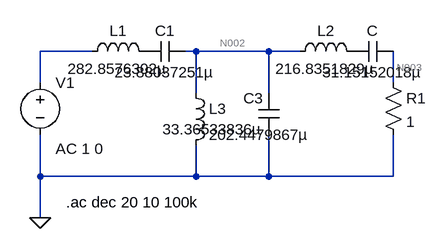
[diagram p0: schematic BPF_chebyshev.asc]
BPF_chebyshev.asc, the LTspice schematic file:
Version 4
SHEET 1 880 680
WIRE 16 240 -64 240
WIRE 176 240 160 240
WIRE 288 240 176 240
WIRE 336 240 288 240
WIRE -64 288 -64 240
WIRE 480 288 480 240
WIRE 176 304 176 240
WIRE 288 304 288 240
WIRE -64 432 -64 368
WIRE 176 432 176 384
WIRE 176 432 -64 432
WIRE 288 432 288 368
WIRE 288 432 176 432
WIRE 480 432 480 368
WIRE 480 432 288 432
WIRE -64 496 -64 432
FLAG -64 496 0
SYMBOL ind 0 256 R270
WINDOW 0 32 56 VTop 2
WINDOW 3 5 56 VBottom 2
SYMATTR InstName L1
SYMATTR Value 282.8576302µ
SYMBOL ind 320 256 R270
WINDOW 0 32 56 VTop 2
WINDOW 3 5 56 VBottom 2
SYMATTR InstName L2
SYMATTR Value 216.8351829µ
SYMBOL ind 160 288 R0
SYMATTR InstName L3
SYMATTR Value 202.4479867µ
SYMBOL cap 160 224 R90
WINDOW 0 0 32 VBottom 2
WINDOW 3 32 32 VTop 2
SYMATTR InstName C1
SYMATTR Value 23.88037251µ
SYMBOL cap 480 224 R90
WINDOW 0 0 32 VBottom 2
WINDOW 3 32 32 VTop 2
SYMATTR InstName C
SYMATTR Value 31.15152018µ
SYMBOL cap 304 368 R180
WINDOW 0 24 56 Left 2
WINDOW 3 24 8 Left 2
SYMATTR InstName C3
SYMATTR Value 33.36533836µ
SYMBOL voltage -64 272 R0
WINDOW 123 24 118 Left 2
SYMATTR InstName V1
SYMATTR Value ""
SYMATTR Value2 AC 1 0
SYMBOL res 464 272 R0
SYMATTR InstName R1
SYMATTR Value 1
TEXT -24 472 Left 2 !.ac dec 20 10 100k

The netlist it stands for:
* BPF_chebyshev.asc
L1 N001 P001 282.8576302µ
L2 N002 P002 216.8351829µ
L3 N002 0 202.4479867µ
C1 N002 P001 23.88037251µ
C N003 P002 31.15152018µ
C3 0 N002 33.36533836µ
V1 N001 0 AC 1 0
R1 N003 0 1
.ac dec 20 10 100k
.backanno
.end

* Results of the author's LTspice run, read from the files saved beside the schematic
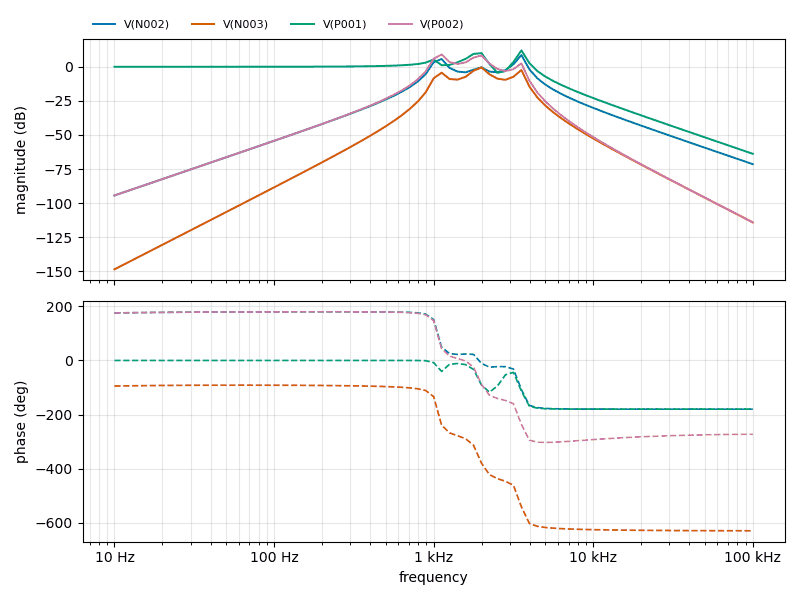
[diagram p1: AC Analysis of BPF_chebyshev.asc, plotted from the saved traces]
* AC Analysis, 1 run:
*   V(N002): -94.36 dB at 10 Hz, -71.41 dB at 100 kHz, peak 8.60 dB at 3.548 kHz, 3 dB below the peak at 3.371 kHz and 3.667 kHz
*   V(N003): -148.52 dB at 10 Hz, -114.10 dB at 100 kHz, peak -0.51 dB at 1.995 kHz, 3 dB below the peak at 1.751 kHz and 2.137 kHz
*   V(P001): 0.00 dB at 10 Hz, -63.82 dB at 100 kHz, peak 12.00 dB at 3.548 kHz, 3 dB below the peak at 3.407 kHz and 3.682 kHz
*   V(P002): -94.36 dB at 10 Hz, -114.08 dB at 100 kHz, peak 9.02 dB at 1.122 kHz, 3 dB below the peak at 1.006 kHz and 1.194 kHz